# Altium schematic sheet ZYNQ_DDR3_MIO_Banks.SchDoc
size A3
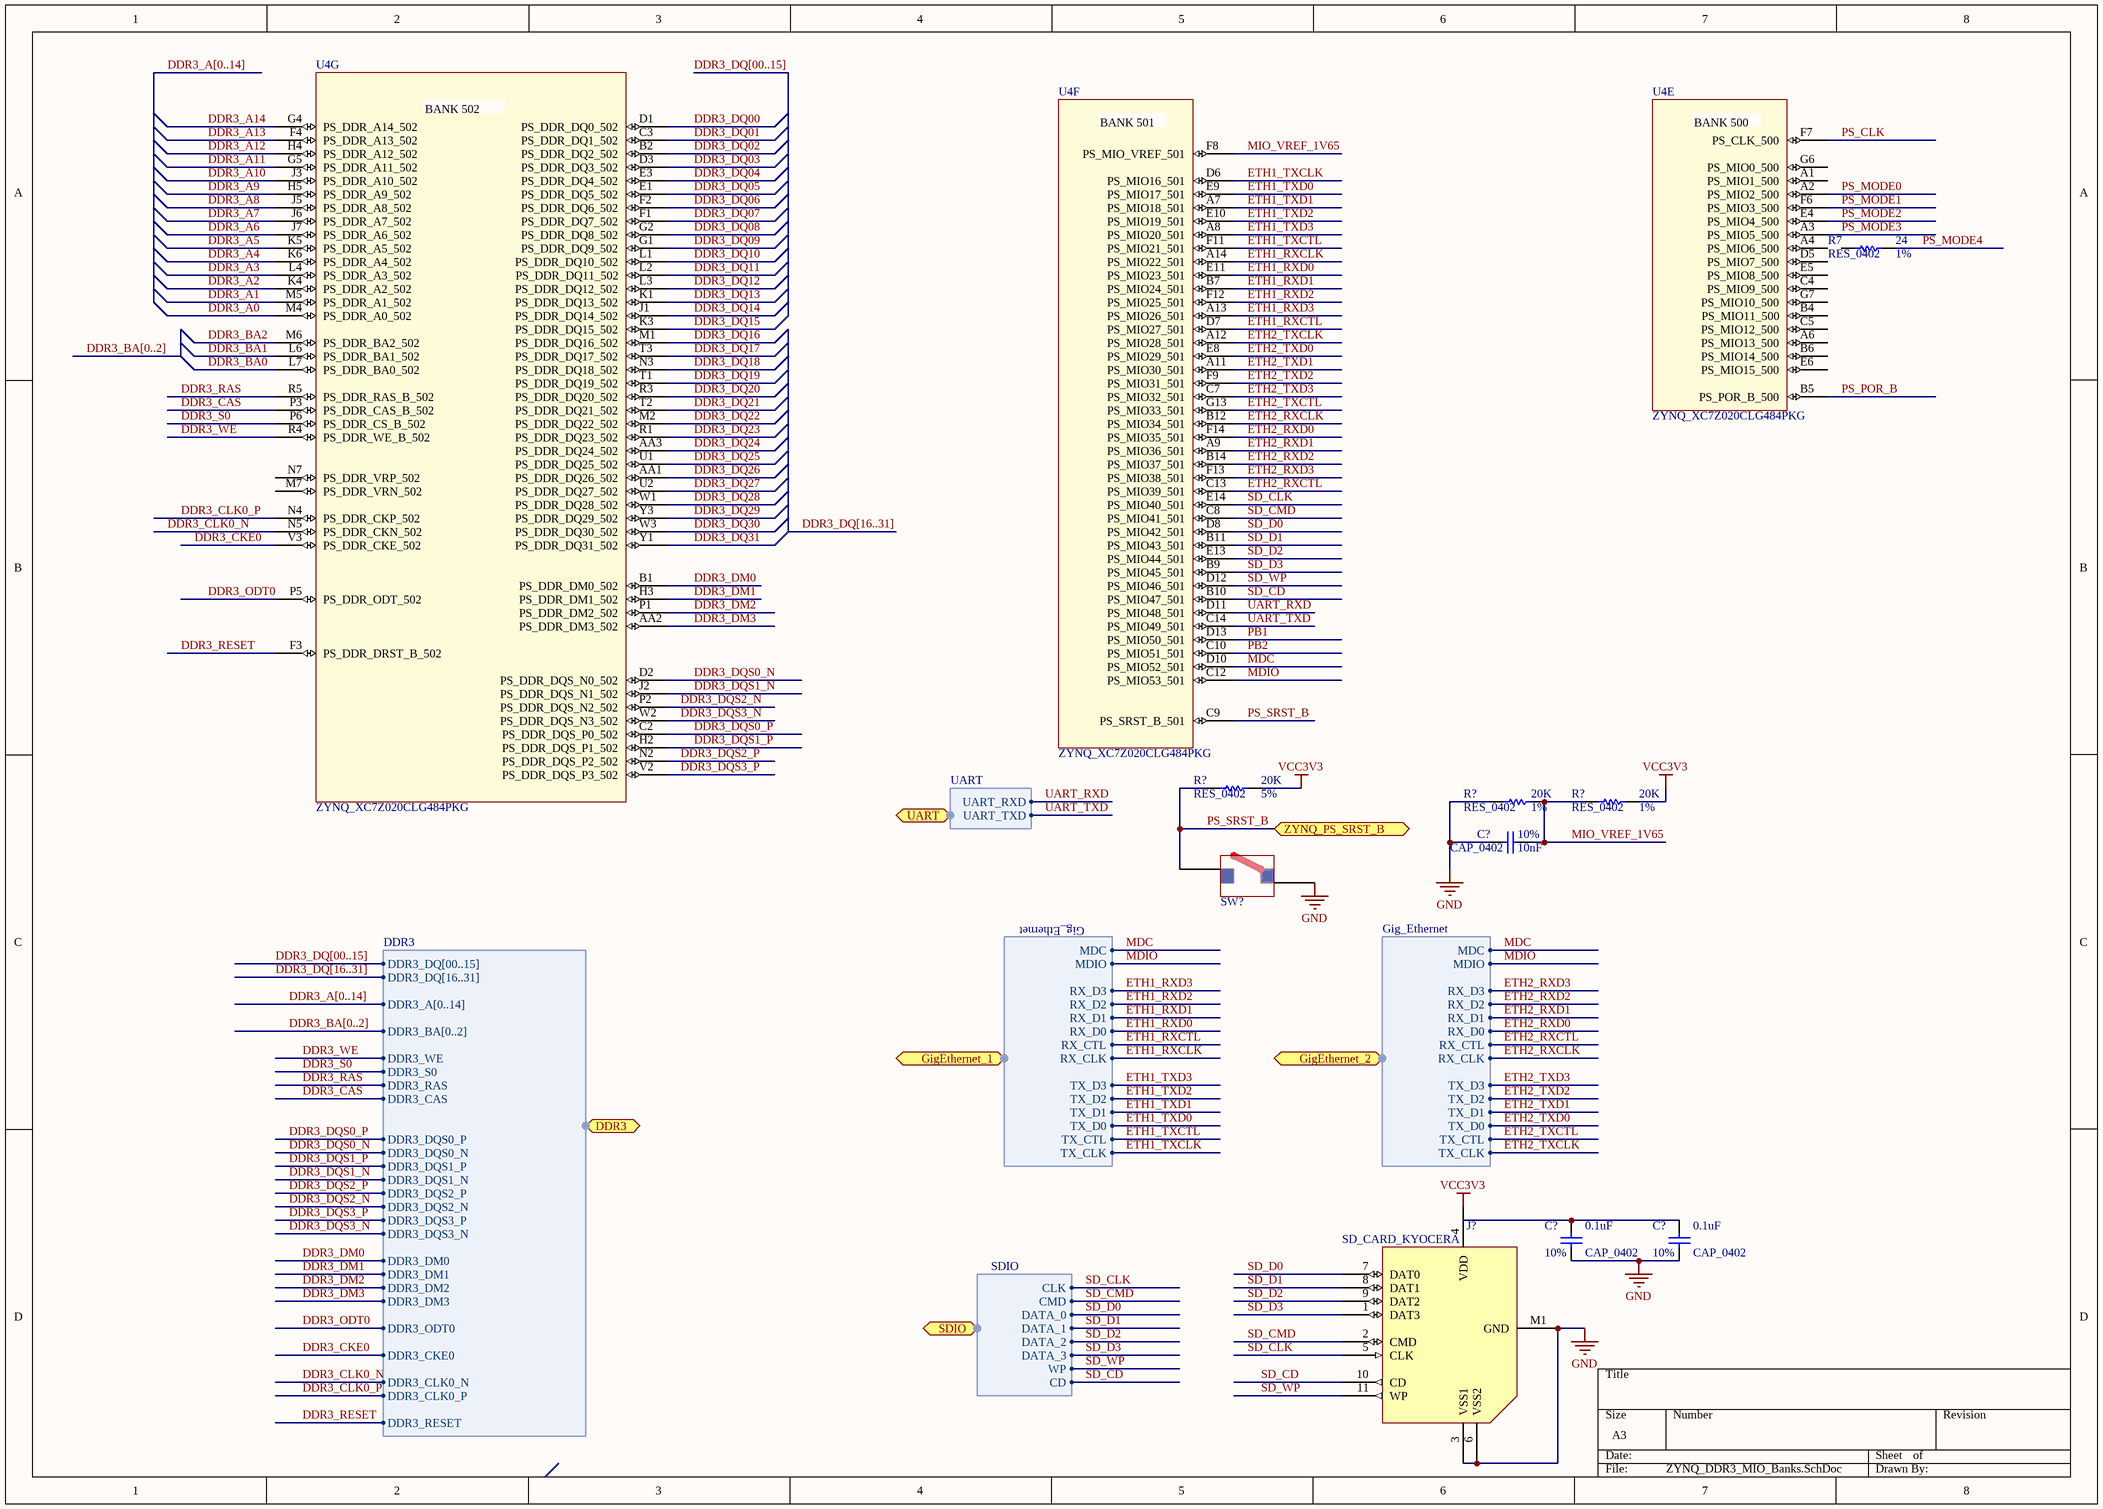
[diagram p0: ZYNQ_DDR3_MIO_Banks.SchDoc]

## Parts
(Parts that share a designator on the sheet are numbered #1, #2 ... from top to bottom, then left to right.)
C?#1  CAP_0402  value 10nF  Tolerance: 10%  [CAPC0402(1005)60_N]
C?#2  CAP_0402  value 0.1uF  Tolerance: 10%  [CAPC0402(1005)60_N]
C?#3  CAP_0402  value 0.1uF  Tolerance: 10%  [CAPC0402(1005)60_N]
J?  SD_CARD_KYOCERA
R7  RES_0402  value 24  Tolerance: 1%  [RESC0402(1005)_N]
R?#1  RES_0402  value 20K  Tolerance: 5%  [RESC0402(1005)_N]
R?#2  RES_0402  value 20K  Tolerance: 1%  [RESC0402(1005)_N]
R?#3  RES_0402  value 20K  Tolerance: 1%  [RESC0402(1005)_N]
SW?  Switch  (value not drawn)
U4  ZYNQ_XC7Z020CLG484PKG  (parts E,F,G of 10)

## Ports
DDR3 (harness DDR3), GigEthernet_1 (harness Gig_Ethernet), GigEthernet_2 (harness Gig_Ethernet), SDIO (harness SDIO), UART (harness UART), ZYNQ_PS_SRST_B

## Harnesses
DDR3: DDR3_DQ[00..15], DDR3_DQ[16..31], DDR3_A[0..14], DDR3_BA[0..2], DDR3_WE, DDR3_S0, DDR3_RAS, DDR3_CAS, DDR3_DQS0_P, DDR3_DQS0_N, DDR3_DQS1_P, DDR3_DQS1_N, DDR3_DQS2_P, DDR3_DQS2_N, DDR3_DQS3_P, DDR3_DQS3_N, DDR3_DM0, DDR3_DM1, DDR3_DM2, DDR3_DM3, DDR3_ODT0, DDR3_CKE0, DDR3_CLK0_N, DDR3_CLK0_P, DDR3_RESET
UART: UART_TXD, UART_RXD
Gig_Ethernet: TX_CLK, TX_CTL, TX_D0, TX_D1, TX_D2, TX_D3, RX_D0, RX_D1, RX_D2, RX_D3, RX_CLK, RX_CTL, MDIO, MDC
SDIO: CLK, CMD, DATA_0, DATA_1, DATA_2, DATA_3, WP, CD

## Nets
GND: C?#1.2 C?#2.2 C?#3.2 J?.3(VSS1) J?.6(VSS2) J?.M1(GND) R?#2.1 SW?.?1
VCC3V3: J?.4(VDD) R?#1.2 R?#3.2
DDR3_A0: U4.M4(PS_DDR_A0_502)
DDR3_A1: U4.M5(PS_DDR_A1_502)
DDR3_A2: U4.K4(PS_DDR_A2_502)
DDR3_A3: U4.L4(PS_DDR_A3_502)
DDR3_A4: U4.K6(PS_DDR_A4_502)
DDR3_A5: U4.K5(PS_DDR_A5_502)
DDR3_A6: U4.J7(PS_DDR_A6_502)
DDR3_A7: U4.J6(PS_DDR_A7_502)
DDR3_A8: U4.J5(PS_DDR_A8_502)
DDR3_A9: U4.H5(PS_DDR_A9_502)
DDR3_A10: U4.J3(PS_DDR_A10_502)
DDR3_A11: U4.G5(PS_DDR_A11_502)
DDR3_A12: U4.H4(PS_DDR_A12_502)
DDR3_A13: U4.F4(PS_DDR_A13_502)
DDR3_A14: U4.G4(PS_DDR_A14_502)
DDR3_BA0: U4.L7(PS_DDR_BA0_502)
DDR3_BA1: U4.L6(PS_DDR_BA1_502)
DDR3_BA2: U4.M6(PS_DDR_BA2_502)
DDR3_CAS: U4.P3(PS_DDR_CAS_B_502) ; port DDR3.DDR3_CAS
DDR3_CKE0: U4.V3(PS_DDR_CKE_502) ; port DDR3.DDR3_CKE0
DDR3_CLK0_N: U4.N5(PS_DDR_CKN_502) ; port DDR3.DDR3_CLK0_N
DDR3_CLK0_P: U4.N4(PS_DDR_CKP_502) ; port DDR3.DDR3_CLK0_P
DDR3_DM0: U4.B1(PS_DDR_DM0_502) ; port DDR3.DDR3_DM0
DDR3_DM1: U4.H3(PS_DDR_DM1_502) ; port DDR3.DDR3_DM1
DDR3_DM2: U4.P1(PS_DDR_DM2_502) ; port DDR3.DDR3_DM2
DDR3_DM3: U4.AA2(PS_DDR_DM3_502) ; port DDR3.DDR3_DM3
DDR3_DQ00: U4.D1(PS_DDR_DQ0_502)
DDR3_DQ01: U4.C3(PS_DDR_DQ1_502)
DDR3_DQ02: U4.B2(PS_DDR_DQ2_502)
DDR3_DQ03: U4.D3(PS_DDR_DQ3_502)
DDR3_DQ04: U4.E3(PS_DDR_DQ4_502)
DDR3_DQ05: U4.E1(PS_DDR_DQ5_502)
DDR3_DQ06: U4.F2(PS_DDR_DQ6_502)
DDR3_DQ07: U4.F1(PS_DDR_DQ7_502)
DDR3_DQ08: U4.G2(PS_DDR_DQ8_502)
DDR3_DQ09: U4.G1(PS_DDR_DQ9_502)
DDR3_DQ10: U4.L1(PS_DDR_DQ10_502)
DDR3_DQ11: U4.L2(PS_DDR_DQ11_502)
DDR3_DQ12: U4.L3(PS_DDR_DQ12_502)
DDR3_DQ13: U4.K1(PS_DDR_DQ13_502)
DDR3_DQ14: U4.J1(PS_DDR_DQ14_502)
DDR3_DQ15: U4.K3(PS_DDR_DQ15_502)
DDR3_DQ16: U4.M1(PS_DDR_DQ16_502)
DDR3_DQ17: U4.T3(PS_DDR_DQ17_502)
DDR3_DQ18: U4.N3(PS_DDR_DQ18_502)
DDR3_DQ19: U4.T1(PS_DDR_DQ19_502)
DDR3_DQ20: U4.R3(PS_DDR_DQ20_502)
DDR3_DQ21: U4.T2(PS_DDR_DQ21_502)
DDR3_DQ22: U4.M2(PS_DDR_DQ22_502)
DDR3_DQ23: U4.R1(PS_DDR_DQ23_502)
DDR3_DQ24: U4.AA3(PS_DDR_DQ24_502)
DDR3_DQ25: U4.U1(PS_DDR_DQ25_502)
DDR3_DQ26: U4.AA1(PS_DDR_DQ26_502)
DDR3_DQ27: U4.U2(PS_DDR_DQ27_502)
DDR3_DQ28: U4.W1(PS_DDR_DQ28_502)
DDR3_DQ29: U4.Y3(PS_DDR_DQ29_502)
DDR3_DQ30: U4.W3(PS_DDR_DQ30_502)
DDR3_DQ31: U4.Y1(PS_DDR_DQ31_502)
DDR3_DQS0_N: U4.D2(PS_DDR_DQS_N0_502) ; port DDR3.DDR3_DQS0_N
DDR3_DQS0_P: U4.C2(PS_DDR_DQS_P0_502) ; port DDR3.DDR3_DQS0_P
DDR3_DQS1_N: U4.J2(PS_DDR_DQS_N1_502) ; port DDR3.DDR3_DQS1_N
DDR3_DQS1_P: U4.H2(PS_DDR_DQS_P1_502) ; port DDR3.DDR3_DQS1_P
DDR3_DQS2_N: U4.P2(PS_DDR_DQS_N2_502) ; port DDR3.DDR3_DQS2_N
DDR3_DQS2_P: U4.N2(PS_DDR_DQS_P2_502) ; port DDR3.DDR3_DQS2_P
DDR3_DQS3_N: U4.W2(PS_DDR_DQS_N3_502) ; port DDR3.DDR3_DQS3_N
DDR3_DQS3_P: U4.V2(PS_DDR_DQS_P3_502) ; port DDR3.DDR3_DQS3_P
DDR3_ODT0: U4.P5(PS_DDR_ODT_502) ; port DDR3.DDR3_ODT0
DDR3_RAS: U4.R5(PS_DDR_RAS_B_502) ; port DDR3.DDR3_RAS
DDR3_RESET: U4.F3(PS_DDR_DRST_B_502) ; port DDR3.DDR3_RESET
DDR3_S0: U4.P6(PS_DDR_CS_B_502) ; port DDR3.DDR3_S0
DDR3_WE: U4.R4(PS_DDR_WE_B_502) ; port DDR3.DDR3_WE
ETH1_RXCLK: U4.A14(PS_MIO22_501) ; port GigEthernet_1.RX_CLK
ETH1_RXCTL: U4.D7(PS_MIO27_501) ; port GigEthernet_1.RX_CTL
ETH1_RXD0: U4.E11(PS_MIO23_501) ; port GigEthernet_1.RX_D0
ETH1_RXD1: U4.B7(PS_MIO24_501) ; port GigEthernet_1.RX_D1
ETH1_RXD2: U4.F12(PS_MIO25_501) ; port GigEthernet_1.RX_D2
ETH1_RXD3: U4.A13(PS_MIO26_501) ; port GigEthernet_1.RX_D3
ETH1_TXCLK: U4.D6(PS_MIO16_501)
ETH1_TXCTL: U4.F11(PS_MIO21_501)
ETH1_TXD0: U4.E9(PS_MIO17_501) ; port GigEthernet_1.TX_D0
ETH1_TXD1: U4.A7(PS_MIO18_501) ; port GigEthernet_1.TX_D1
ETH1_TXD2: U4.E10(PS_MIO19_501) ; port GigEthernet_1.TX_D2
ETH1_TXD3: U4.A8(PS_MIO20_501) ; port GigEthernet_1.TX_D3
ETH2_RXCLK: U4.B12(PS_MIO34_501) ; port GigEthernet_2.RX_CLK
ETH2_RXCTL: U4.C13(PS_MIO39_501) ; port GigEthernet_2.RX_CTL
ETH2_RXD0: U4.F14(PS_MIO35_501) ; port GigEthernet_2.RX_D0
ETH2_RXD1: U4.A9(PS_MIO36_501) ; port GigEthernet_2.RX_D1
ETH2_RXD2: U4.B14(PS_MIO37_501) ; port GigEthernet_2.RX_D2
ETH2_RXD3: U4.F13(PS_MIO38_501) ; port GigEthernet_2.RX_D3
ETH2_TXCLK: U4.A12(PS_MIO28_501)
ETH2_TXCTL: U4.G13(PS_MIO33_501)
ETH2_TXD0: U4.E8(PS_MIO29_501) ; port GigEthernet_2.TX_D0
ETH2_TXD1: U4.A11(PS_MIO30_501) ; port GigEthernet_2.TX_D1
ETH2_TXD2: U4.F9(PS_MIO31_501) ; port GigEthernet_2.TX_D2
ETH2_TXD3: U4.C7(PS_MIO32_501) ; port GigEthernet_2.TX_D3
MDC: U4.D10(PS_MIO52_501) ; port GigEthernet_1.MDC, port GigEthernet_2.MDC
MDIO: U4.C12(PS_MIO53_501) ; port GigEthernet_1.MDIO, port GigEthernet_2.MDIO
MIO_VREF_1V65: C?#1.1 R?#2.2 R?#3.1 U4.F8(PS_MIO_VREF_501)
PB1: U4.D13(PS_MIO50_501)
PB2: U4.C10(PS_MIO51_501)
PS_CLK: U4.F7(PS_CLK_500)
PS_MODE0: U4.A2(PS_MIO2_500)
PS_MODE1: U4.F6(PS_MIO3_500)
PS_MODE2: U4.E4(PS_MIO4_500)
PS_MODE3: U4.A3(PS_MIO5_500)
PS_MODE4: R7.2
PS_POR_B: U4.B5(PS_POR_B_500)
PS_SRST_B: R?#1.1 SW?.?2 U4.C9(PS_SRST_B_501) ; port ZYNQ_PS_SRST_B
SD_CD: J?.10(CD) U4.B10(PS_MIO47_501) ; port SDIO.CD
SD_CLK: J?.5(CLK) U4.E14(PS_MIO40_501) ; port SDIO.CLK
SD_CMD: J?.2(CMD) U4.C8(PS_MIO41_501) ; port SDIO.CMD
SD_D0: J?.7(DAT0) U4.D8(PS_MIO42_501) ; port SDIO.DATA_0
SD_D1: J?.8(DAT1) U4.B11(PS_MIO43_501) ; port SDIO.DATA_1
SD_D2: J?.9(DAT2) U4.E13(PS_MIO44_501) ; port SDIO.DATA_2
SD_D3: J?.1(DAT3) U4.B9(PS_MIO45_501) ; port SDIO.DATA_3
SD_WP: J?.11(WP) U4.D12(PS_MIO46_501) ; port SDIO.WP
UART_RXD: U4.D11(PS_MIO48_501)
UART_TXD: U4.C14(PS_MIO49_501)
NetC?#2_1: C?#2.1 C?#3.1

Not connected (* = marked no-connect by the designer): R7 1; U4 A1(PS_MIO1_500) A4(PS_MIO6_500) A6(PS_MIO13_500) B4(PS_MIO11_500) B6(PS_MIO14_500) C4(PS_MIO9_500) C5(PS_MIO12_500) D5(PS_MIO7_500) E5(PS_MIO8_500) E6(PS_MIO15_500) G6(PS_MIO0_500) G7(PS_MIO10_500) M7(PS_DDR_VRN_502) N7(PS_DDR_VRP_502)

## Buses and harness runs
bus DDR3_A[0..14]
bus DDR3_BA[0..2]
bus DDR3_DQ[00..15]
bus DDR3_DQ[16..31]

## Notes on the sheet
- (in symbol ZYNQ_XC7Z020CLG484PKG, part E) BANK 500
- (in symbol ZYNQ_XC7Z020CLG484PKG, part F) BANK 501
- (in symbol ZYNQ_XC7Z020CLG484PKG, part G) BANK 502

## Library data of the parts
J? = SD_CARD_Connector